# EAGLE schematic BMP085 (EAGLE 4.16)
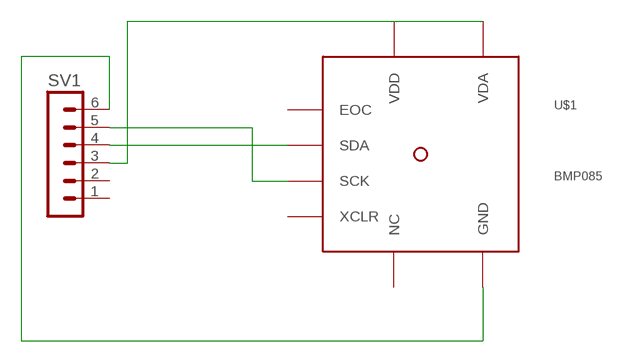
[diagram p0: schematic, sheet 1]

## Parts
SV1  MA06-1  [MA06-1]
U$1  BMP085  [LCC8]

## Nets
GND: SV1.6 U$1.P$1(GND)
SCK: SV1.5 U$1.P$6(SCK)
SDA: SV1.4 U$1.P$7(SDA)
VDD3_3: SV1.3 U$1.P$3(VDA) U$1.P$4(VDD)
Unconnected: SV1.1 SV1.2 U$1.P$2(EOC) U$1.P$5(NC) U$1.P$8(XCLR)

## Library data of the parts
SV1 = con-lstb:MA06-1: PIN HEADER
U$1 = Stofer:BMP085